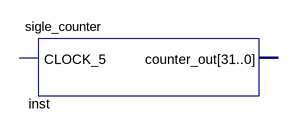
[diagram p0: schematic sheet]
// Quartus schematic my_first_fpga.bdf as structural Verilog: 1 symbols, 0 pins
module my_first_fpga (
);

  sigle_counter inst ();  // open: CLOCK_5, counter_out
endmodule
